# Altium schematic sheet peripheralconn.SCHDOC: Backplane
size B; Engineer: Eric Jonas; Organization: Wilson Lab; Address1: Picower Institute, MIT; Address2: 43 Vassar St. 46-5227; Address3: Cambridge, MA 02139; Address4: Australia 2086
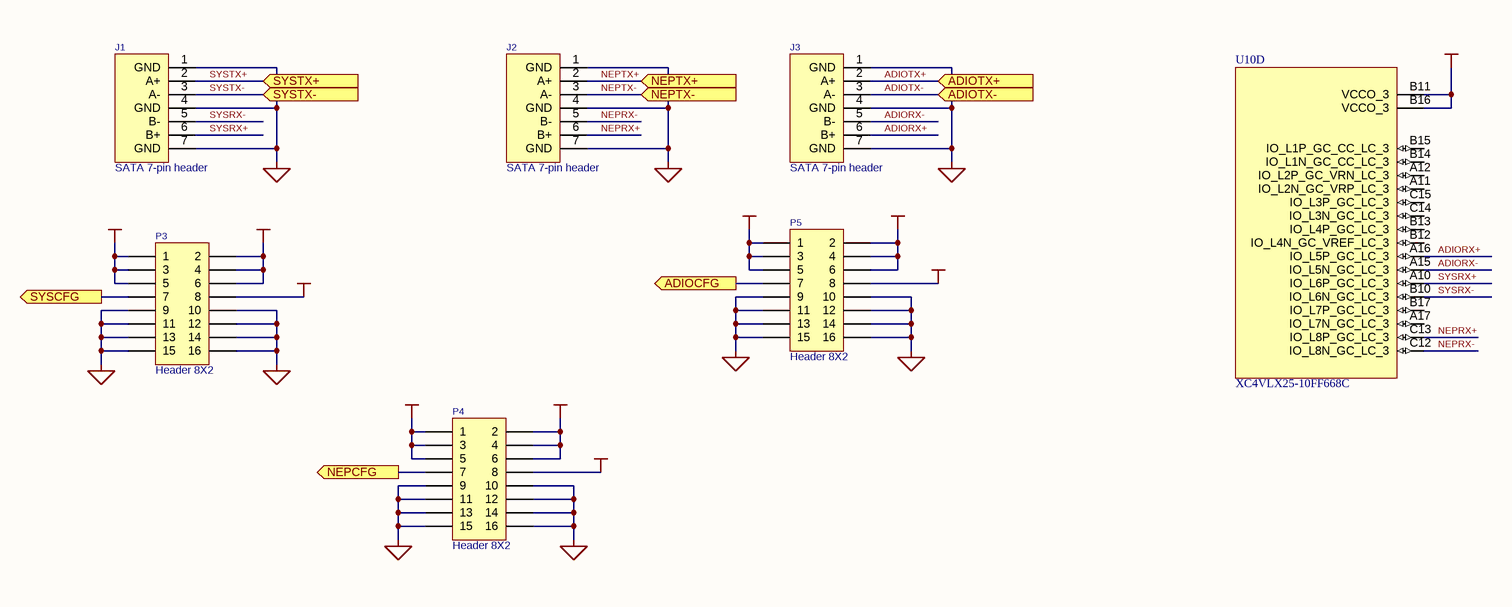
[diagram p0: peripheralconn.SCHDOC]

## Parts
J1  SATA 7-pin header  [MOLES 67800-5005]
J2  SATA 7-pin header  [MOLES 67800-5005]
J3  SATA 7-pin header  [MOLES 67800-5005]
P3  Header 8X2  [MOLEX 15-91-2160]
P4  Header 8X2  [MOLEX 15-91-2160]
P5  Header 8X2  [MOLEX 15-91-2160]
U10  XC4VLX25-10FF668C  [Xilinx FF668]  (part D of 13)

## Ports
ADIOCFG (out), ADIOTX+ (in), ADIOTX- (in), NEPCFG (out), NEPTX+ (in), NEPTX- (in), SYSCFG (out), SYSTX+ (in), SYSTX- (in)

## Nets
+2.5VCC: U10.B11(VCCO_3) U10.B16(VCCO_3)
+5VCC: P3.2 P3.4 P3.6 P4.2 P4.4 P4.6 P5.2 P5.4 P5.6
+12VCC: P3.8 P4.8 P5.8
GND: J1.1(GND) J1.4(GND) J1.7(GND) J2.1(GND) J2.4(GND) J2.7(GND) J3.1(GND) J3.4(GND) J3.7(GND) P3.9 P3.10 P3.11 P3.12 P3.13 P3.14 P3.15 P3.16 P4.9 P4.10 P4.11 P4.12 P4.13 P4.14 P4.15 P4.16 P5.9 P5.10 P5.11 P5.12 P5.13 P5.14 P5.15 P5.16
VCC: P3.1 P3.3 P3.5 P4.1 P4.3 P4.5 P5.1 P5.3 P5.5
ADIOCFG: P5.7 ; port ADIOCFG
ADIORX+: J3.6(B+) U10.A16(IO_L5P_GC_LC_3)
ADIORX-: J3.5(B-) U10.A15(IO_L5N_GC_LC_3)
ADIOTX+: J3.2(A+) ; port ADIOTX+
ADIOTX-: J3.3(A-) ; port ADIOTX-
NEPCFG: P4.7 ; port NEPCFG
NEPRX+: J2.6(B+) U10.C13(IO_L8P_GC_LC_3)
NEPRX-: J2.5(B-) U10.C12(IO_L8N_GC_LC_3)
NEPTX+: J2.2(A+) ; port NEPTX+
NEPTX-: J2.3(A-) ; port NEPTX-
SYSCFG: P3.7 ; port SYSCFG
SYSRX+: J1.6(B+) U10.A10(IO_L6P_GC_LC_3)
SYSRX-: J1.5(B-) U10.B10(IO_L6N_GC_LC_3)
SYSTX+: J1.2(A+) ; port SYSTX+
SYSTX-: J1.3(A-) ; port SYSTX-

Not connected (* = marked no-connect by the designer): U10 A11(IO_L2N_GC_VRP_LC_3) A12(IO_L2P_GC_VRN_LC_3) A17(IO_L7N_GC_LC_3) B12(IO_L4N_GC_VREF_LC_3) B13(IO_L4P_GC_LC_3) B14(IO_L1N_GC_CC_LC_3) B15(IO_L1P_GC_CC_LC_3) B17(IO_L7P_GC_LC_3) C14(IO_L3N_GC_LC_3) C15(IO_L3P_GC_LC_3)

## Notes on the sheet
- Title:
- Engineer:
- Date:
- Revision:
- Sheet
- of
- File:

## Library data of the parts
J1-J3 = SATA-7
P3-P5 = Header 8X2: Header, 8-Pin, Dual row; LatestRevisionDate: 17-Jul-2002; LatestRevisionNote: Re-released for DXP Platform.; Publisher: Altium Limited
U10 = XC4VLX25-10FF668C: Xilinx Virtex-4